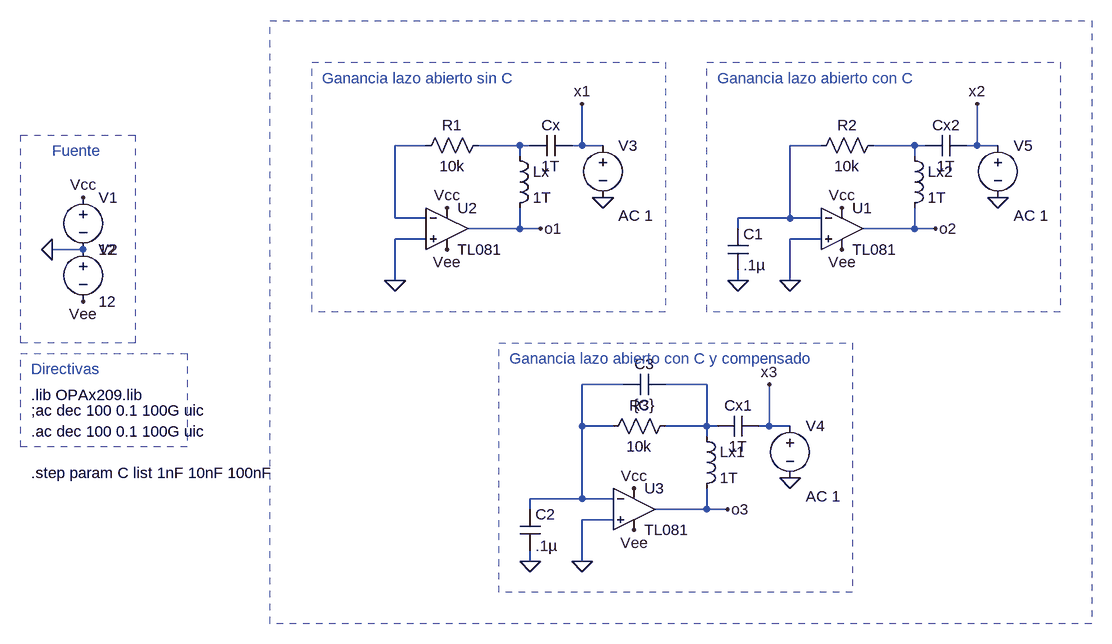
[diagram p0: schematic Amplificacor_rta_freq.asc]
Amplificacor_rta_freq.asc, the LTspice schematic file:
Version 4
SHEET 1 1652 728
WIRE 0 -16 -48 -16
WIRE 144 -16 80 -16
WIRE 160 -16 144 -16
WIRE 240 -16 240 -80
WIRE 240 -16 224 -16
WIRE 272 -16 240 -16
WIRE 608 -16 560 -16
WIRE 752 -16 688 -16
WIRE 768 -16 752 -16
WIRE 848 -16 848 -80
WIRE 848 -16 832 -16
WIRE 880 -16 848 -16
WIRE 144 0 144 -16
WIRE 752 0 752 -16
WIRE -48 96 -48 -16
WIRE 0 96 -48 96
WIRE 560 96 560 -16
WIRE 560 96 480 96
WIRE 608 96 560 96
WIRE 144 112 144 80
WIRE 144 112 64 112
WIRE 176 112 144 112
WIRE 480 112 480 96
WIRE 752 112 752 80
WIRE 752 112 672 112
WIRE 784 112 752 112
WIRE 0 128 -48 128
WIRE 608 128 560 128
WIRE -528 144 -576 144
WIRE -48 192 -48 128
WIRE 480 192 480 176
WIRE 560 192 560 128
WIRE 304 352 240 352
WIRE 432 352 368 352
WIRE 240 416 240 352
WIRE 288 416 240 416
WIRE 432 416 432 352
WIRE 432 416 368 416
WIRE 448 416 432 416
WIRE 528 416 528 352
WIRE 528 416 512 416
WIRE 560 416 528 416
WIRE 432 432 432 416
WIRE 240 528 240 416
WIRE 240 528 160 528
WIRE 288 528 240 528
WIRE 160 544 160 528
WIRE 432 544 432 512
WIRE 432 544 352 544
WIRE 464 544 432 544
WIRE 288 560 240 560
WIRE 160 624 160 608
WIRE 240 624 240 560
FLAG -576 144 0
FLAG -528 224 Vee
FLAG -528 64 Vcc
FLAG -48 192 0
FLAG 272 64 0
FLAG 32 144 Vee
FLAG 32 80 Vcc
FLAG 176 112 o1
FLAG 240 -80 x1
FLAG 560 192 0
FLAG 880 64 0
FLAG 640 144 Vee
FLAG 640 80 Vcc
FLAG 784 112 o2
FLAG 848 -80 x2
FLAG 480 192 0
FLAG 240 624 0
FLAG 560 496 0
FLAG 320 576 Vee
FLAG 320 512 Vcc
FLAG 464 544 o3
FLAG 528 352 x3
FLAG 160 624 0
SYMBOL voltage -528 48 R0
WINDOW 123 0 0 Left 0
WINDOW 39 0 0 Left 0
SYMATTR InstName V1
SYMATTR Value 12
SYMBOL voltage -528 128 R0
WINDOW 123 0 0 Left 0
WINDOW 39 0 0 Left 0
SYMATTR InstName V2
SYMATTR Value 12
SYMBOL res 96 -32 R90
WINDOW 0 0 56 VBottom 2
WINDOW 3 32 56 VTop 2
SYMATTR InstName R1
SYMATTR Value 10k
SYMBOL ind 128 -16 R0
SYMATTR InstName Lx
SYMATTR Value 1T
SYMBOL cap 224 -32 R90
WINDOW 0 0 32 VBottom 2
WINDOW 3 32 32 VTop 2
SYMATTR InstName Cx
SYMATTR Value 1T
SYMBOL voltage 272 -32 R0
WINDOW 123 24 124 Left 2
WINDOW 39 0 0 Left 0
SYMATTR Value2 AC 1
SYMATTR InstName V3
SYMATTR Value ""
SYMBOL AutoGenerated\\TL081 32 112 R0
SYMATTR InstName U2
SYMATTR Value TL081
SYMBOL res 704 -32 R90
WINDOW 0 0 56 VBottom 2
WINDOW 3 32 56 VTop 2
SYMATTR InstName R2
SYMATTR Value 10k
SYMBOL ind 736 -16 R0
SYMATTR InstName Lx2
SYMATTR Value 1T
SYMBOL cap 832 -32 R90
WINDOW 0 0 32 VBottom 2
WINDOW 3 32 32 VTop 2
SYMATTR InstName Cx2
SYMATTR Value 1T
SYMBOL voltage 880 -32 R0
WINDOW 123 24 124 Left 2
WINDOW 39 0 0 Left 0
SYMATTR Value2 AC 1
SYMATTR InstName V5
SYMATTR Value ""
SYMBOL AutoGenerated\\TL081 640 112 R0
SYMATTR InstName U1
SYMATTR Value TL081
SYMBOL cap 464 112 R0
SYMATTR InstName C1
SYMATTR Value .1µ
SYMBOL res 384 400 R90
WINDOW 0 0 56 VBottom 2
WINDOW 3 32 56 VTop 2
SYMATTR InstName R3
SYMATTR Value 10k
SYMBOL ind 416 416 R0
SYMATTR InstName Lx1
SYMATTR Value 1T
SYMBOL cap 512 400 R90
WINDOW 0 0 32 VBottom 2
WINDOW 3 32 32 VTop 2
SYMATTR InstName Cx1
SYMATTR Value 1T
SYMBOL voltage 560 400 R0
WINDOW 123 24 124 Left 2
WINDOW 39 0 0 Left 0
SYMATTR Value2 AC 1
SYMATTR InstName V4
SYMATTR Value ""
SYMBOL AutoGenerated\\TL081 320 544 R0
SYMATTR InstName U3
SYMATTR Value TL081
SYMBOL cap 144 544 R0
SYMATTR InstName C2
SYMATTR Value .1µ
SYMBOL cap 368 336 R90
WINDOW 0 0 32 VBottom 2
WINDOW 3 32 32 VTop 2
SYMATTR InstName C3
SYMATTR Value {C}
TEXT -608 392 Left 2 !;ac dec 100 0.1 100G uic
TEXT -608 368 Left 2 !.lib OPAx209.lib
TEXT -160 -120 Left 2 ;Ganancia lazo abierto sin C
TEXT -608 328 Left 2 ;Directivas
TEXT -576 -8 Left 2 ;Fuente
TEXT -608 424 Left 2 !.ac dec 100 0.1 100G uic
TEXT 448 -120 Left 2 ;Ganancia lazo abierto con C
TEXT 128 312 Left 2 ;Ganancia lazo abierto con C y compensado
TEXT -608 488 Left 2 !.step param C list 1nF 10nF 100nF
RECTANGLE Normal 368 240 -176 -144 2
RECTANGLE Normal -368 448 -624 304 2
RECTANGLE Normal -448 288 -624 -32 2
RECTANGLE Normal 976 240 432 -144 2
RECTANGLE Normal 656 672 112 288 2
RECTANGLE Normal 1024 720 -240 -208 2

The netlist it stands for:
* Amplificacor_rta_freq.asc
V1 Vcc 0 12
V2 0 Vee 12
R1 N002 N001 10k
Lx N002 o1 1T
Cx x1 N002 1T
V3 x1 0 AC 1
* U2: TL081 (symbol AutoGenerated\TL081 not available, pins judged from their places): In+=0 In-=N001 V+=Vcc V-=Vee OUT=o1
R2 N004 N003 10k
Lx2 N004 o2 1T
Cx2 x2 N004 1T
V5 x2 0 AC 1
* U1: TL081 (symbol AutoGenerated\TL081 not available, pins judged from their places): In+=0 In-=N003 V+=Vcc V-=Vee OUT=o2
C1 N003 0 .1µ
R3 N006 N005 10k
Lx1 N006 o3 1T
Cx1 x3 N006 1T
V4 x3 0 AC 1
* U3: TL081 (symbol AutoGenerated\TL081 not available, pins judged from their places): In+=0 In-=N005 V+=Vcc V-=Vee OUT=o3
C2 N005 0 .1µ
C3 N006 N005 {C}
;ac dec 100 0.1 100G uic
.lib OPAx209.lib
* Ganancia lazo abierto sin C
* Directivas
* Fuente
.ac dec 100 0.1 100G uic
* Ganancia lazo abierto con C
* Ganancia lazo abierto con C y compensado
.step param C list 1nF 10nF 100nF
.backanno
.end